# Altium project Receiver.PrjPCB
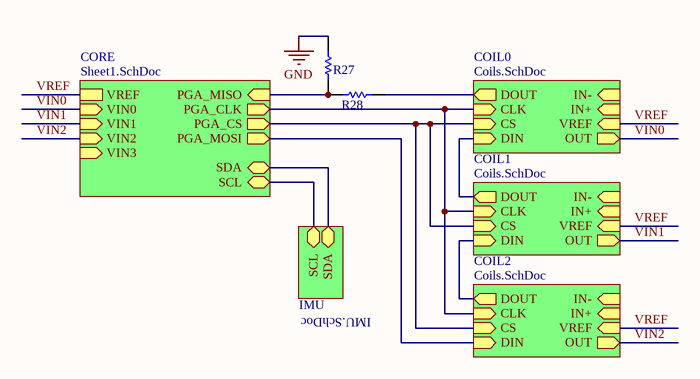
[diagram p0: Top.SchDoc]
4 sheets, 113 parts. Net scope: hierarchical (ports join the sheet entries above them; power ports are global).
Board file: PCB1.PcbDoc
Sheets:
  Top.SchDoc
    CORE = Sheet1.SchDoc
    IMU = IMU.SchDoc
    COIL0 = Coils.SchDoc
    COIL1 = Coils.SchDoc
    COIL2 = Coils.SchDoc

## Sheet Top.SchDoc
size A4

### Parts
R27  10K 1% 0402(1005)  [RESC0402(1005)_N]  (value not drawn)
R28  5K6 5% 0402(1005)  [RESC0402(1005)_N]  (value not drawn)

### Sub-sheets
COIL0 = Coils.SchDoc: DIN (in), CLK (in), CS (in), DOUT (out), OUT (out), IN- (in), IN+ (in), VREF (in)
COIL1 = Coils.SchDoc: DIN (in), CLK (in), CS (in), DOUT (out), OUT (out), IN- (in), IN+ (in), VREF (in)
COIL2 = Coils.SchDoc: DIN (in), CLK (in), CS (in), DOUT (out), OUT (out), IN- (in), IN+ (in), VREF (in)
CORE = Sheet1.SchDoc: SDA (bidir), SCL (bidir), PGA_CLK (out), PGA_MISO (in), PGA_MOSI (out), VREF, VIN0 (in), VIN1 (in), VIN2 (in), VIN3 (in), PGA_CS (out)
IMU = IMU.SchDoc: SDA (bidir), SCL (bidir)

### Nets
GND: R27.1
PGA_CLK: sheet CORE/PGA_CLK, sheet COIL0/CLK, sheet COIL1/CLK, sheet COIL2/CLK
PGA_CS: sheet CORE/PGA_CS, sheet COIL0/CS, sheet COIL1/CS, sheet COIL2/CS
PGA_MISO: R27.2 R28.1 ; sheet CORE/PGA_MISO
PGA_MOSI: sheet CORE/PGA_MOSI, sheet COIL2/DIN
SCL: sheet CORE/SCL, sheet IMU/SCL
SDA: sheet CORE/SDA, sheet IMU/SDA
VIN0: sheet CORE/VIN0, sheet COIL0/OUT
VIN1: sheet CORE/VIN1, sheet COIL1/OUT
VIN2: sheet CORE/VIN2, sheet COIL2/OUT
VREF: sheet CORE/VREF, sheet COIL0/VREF, sheet COIL1/VREF, sheet COIL2/VREF
NetR28_2: R28.2 ; sheet COIL0/DOUT
NetU2A_7: sheet COIL0/DIN, sheet COIL1/DOUT
NetU2B_7: sheet COIL1/DIN, sheet COIL2/DOUT

### Library data of the parts
R27 = CMP-1011-00623-1: 10K 0.063W 1% 0402 (1005 Metric)  SMD; Case-Metric: 1005; Value: 10000.00 Ohm; Case-EIA: 0402; Tolerance: 1 %; Technology: SMT; Power: 0.063 W
R28 = CMP-1011-00092-1: 5K6 0.063W 5% 0402 (1005 Metric)  SMD; Case-EIA: 0402; Case-Metric: 1005; Value: 5600.00 Ohm; Technology: SMT; Tolerance: 5 %; Power: 0.063 W

## Sheet Sheet1.SchDoc
size A4
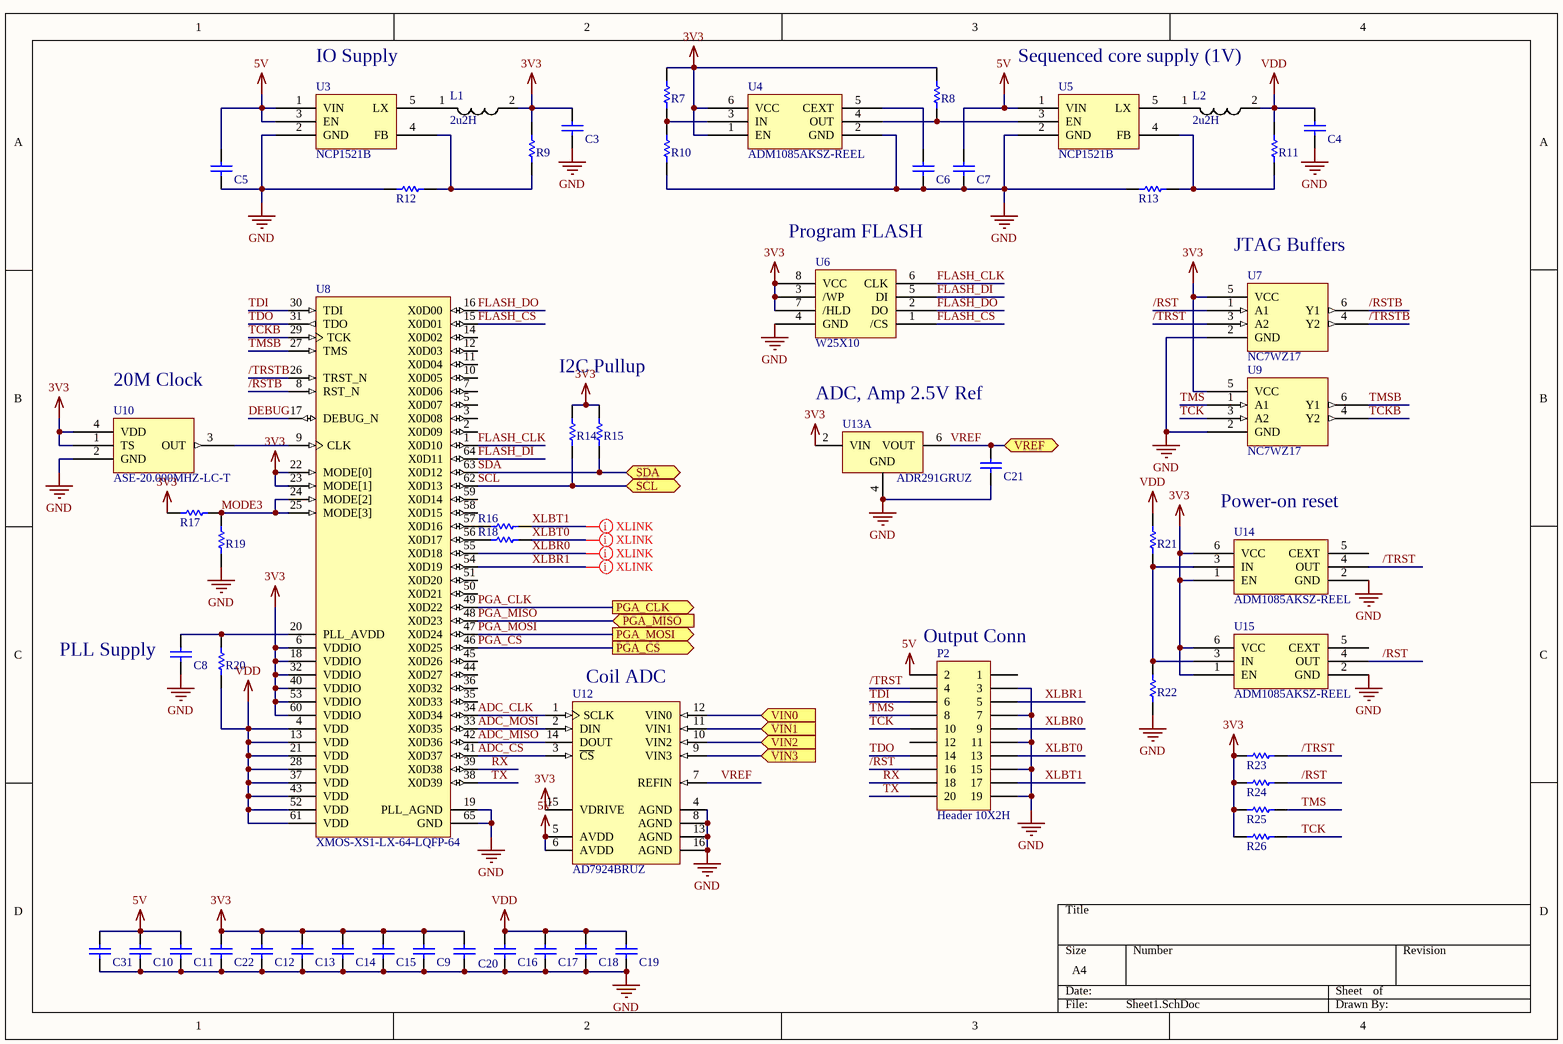
[diagram p1: Sheet1.SchDoc]

### Parts
C3  CAP 10uF 6.3V 0603(1608)  [CAPC0603(1608)100_N]  (value not drawn)
C4  CAP 10uF 6.3V 0603(1608)  [CAPC0603(1608)100_N]  (value not drawn)
C5  CAP 10uF 6.3V 0603(1608)  [CAPC0603(1608)100_N]  (value not drawn)
C6  CAP 10nF 10V 0402(1005)  [CAPC0402(1005)60_N]  (value not drawn)
C7  CAP 10uF 6.3V 0603(1608)  [CAPC0603(1608)100_N]  (value not drawn)
C8  CAP 1uF 16V 0402(1005)  [CAPC0402(1005)60_N]  (value not drawn)
C9  CAP 100nF 25V 0402(1005)  [CAPC0402(1005)60_N]  (value not drawn)
C10  CAP 100nF 25V 0402(1005)  [CAPC0402(1005)60_N]  (value not drawn)
C11  CAP 100nF 25V 0402(1005)  [CAPC0402(1005)60_N]  (value not drawn)
C12  CAP 1uF 16V 0402(1005)  [CAPC0402(1005)60_N]  (value not drawn)
C13  CAP 1uF 16V 0402(1005)  [CAPC0402(1005)60_N]  (value not drawn)
C14  CAP 100nF 25V 0402(1005)  [CAPC0402(1005)60_N]  (value not drawn)
C15  CAP 100nF 25V 0402(1005)  [CAPC0402(1005)60_N]  (value not drawn)
C16  CAP 100nF 25V 0402(1005)  [CAPC0402(1005)60_N]  (value not drawn)
C17  CAP 100nF 25V 0402(1005)  [CAPC0402(1005)60_N]  (value not drawn)
C18  CAP 1uF 16V 0402(1005)  [CAPC0402(1005)60_N]  (value not drawn)
C19  CAP 1uF 16V 0402(1005)  [CAPC0402(1005)60_N]  (value not drawn)
C20  CAP 100nF 25V 0402(1005)  [CAPC0402(1005)60_N]  (value not drawn)
C21  CAP 100nF 25V 0402(1005)  [CAPC0402(1005)60_N]  (value not drawn)
C22  CAP 1uF 16V 0402(1005)  [CAPC0402(1005)60_N]  (value not drawn)
C31  CAP 10uF 6.3V 0603(1608)  [CAPC0603(1608)100_N]  (value not drawn)
L1  2u2H  [2016 Inductor]
L2  2u2H  [2016 Inductor]
P2  Header 10X2H  [HDR2X10H]
R7  36K 1% 0402(1005)  [RESC0402(1005)_N]  (value not drawn)
R8  10K 1% 0402(1005)  [RESC0402(1005)_N]  (value not drawn)
R9  68K 1% 0402(1005)  [RESC0402(1005)_N]  (value not drawn)
R10  10K 1% 0402(1005)  [RESC0402(1005)_N]  (value not drawn)
R11  68K 1% 0402(1005)  [RESC0402(1005)_N]  (value not drawn)
R12  15K 5% 0402(1005)  [RESC0402(1005)_N]  (value not drawn)
R13  100K 1% 0402(1005)  [RESC0402(1005)_N]  (value not drawn)
R14  10K 1% 0402(1005)  [RESC0402(1005)_N]  (value not drawn)
R15  10K 1% 0402(1005)  [RESC0402(1005)_N]  (value not drawn)
R16  33R 5% 0402(1005)  [RESC0402(1005)_N]  (value not drawn)
R17  10K 1% 0402(1005)  [RESC0402(1005)_N]  (value not drawn)
R18  33R 5% 0402(1005)  [RESC0402(1005)_N]  (value not drawn)
R19  Jumper 0402(1005)  [RESC0402(1005)_N]  (value not drawn)
R20  4R7 5% 0402(1005)  [RESC0402(1005)_N]  (value not drawn)
R21  15K 1% 0402(1005)  [RESC0402(1005)_N]  (value not drawn)
R22  36K 1% 0402(1005)  [RESC0402(1005)_N]  (value not drawn)
R23  10K 1% 0402(1005)  [RESC0402(1005)_N]  (value not drawn)
R24  10K 1% 0402(1005)  [RESC0402(1005)_N]  (value not drawn)
R25  10K 1% 0402(1005)  [RESC0402(1005)_N]  (value not drawn)
R26  10K 1% 0402(1005)  [RESC0402(1005)_N]  (value not drawn)
U3  NCP1521B  [TSOP5]
U4  ADM1085AKSZ-REEL  [KS_6]
U5  NCP1521B  [TSOP5]
U6  W25X10  [SO8_N]
U7  NC7WZ17  [KS_6]
U8  XMOS-XS1-LX-64-LQFP-64  [XMOS-LQFP-64_V_MOD]
U9  NC7WZ17  [KS_6]
U10  ASE-20.000MHZ-LC-T  [4-SMD (3.2 x 2.5mm)]
U12  AD7924BRUZ  [RU-16_N]
U13  ADR291GRUZ  [ADI-RU-8_N]  (part A of 2)
U14  ADM1085AKSZ-REEL  [KS_6]
U15  ADM1085AKSZ-REEL  [KS_6]

### Ports
PGA_CLK (out), PGA_CS (out), PGA_MISO (in), PGA_MOSI (out), SCL (bidir), SDA (bidir), VIN0 (in), VIN1 (in), VIN2 (in), VIN3 (in), VREF

### Nets
3V3: C3.2 C9.2 C12.2 C13.2 C14.2 C15.2 C20.2 C22.2 L1.2 R7.2 R8.2 R9.2 R14.2 R15.2 R17.2 R23.2 R24.2 R25.2 R26.2 U4.1(EN) U4.6(VCC) U6.3(/WP) U6.7(/HLD) U6.8(VCC) U7.5(VCC) U8.6(VDDIO) U8.18(VDDIO) U8.22(MODE[0]) U8.23(MODE[1]) U8.32(VDDIO) U8.40(VDDIO) U8.53(VDDIO) U8.60(VDDIO) U9.5(VCC) U10.1(TS) U10.4(VDD) U12.15(VDRIVE) U13.2(VIN) U14.1(EN) U14.6(VCC) U15.1(EN) U15.6(VCC)
5V: C5.1 C7.1 C10.2 C11.2 C31.1 P2.2 U3.1(VIN) U3.3(EN) U5.1(VIN) U12.5(AVDD) U12.6(AVDD)
GND: C3.1 C4.1 C5.2 C6.1 C7.2 C8.2 C9.1 C10.1 C11.1 C12.1 C13.1 C14.1 C15.1 C16.1 C17.1 C18.1 C19.1 C20.1 C21.1 C22.1 C31.2 P2.3 P2.7 P2.11 P2.15 P2.19 R10.1 R12.1 R13.1 R19.1 R22.1 U3.2(GND) U4.2(GND) U5.2(GND) U6.4(GND) U7.2(GND) U8.19(PLL_AGND) U8.65(GND) U9.2(GND) U10.2(GND) U12.4(AGND) U12.8(AGND) U12.13(AGND) U12.16(AGND) U13.4(GND) U14.2(GND) U15.2(GND)
VDD: C4.2 C16.2 C17.2 C18.2 C19.2 L2.2 R11.2 R20.1 R21.2 U8.4(VDD) U8.13(VDD) U8.21(VDD) U8.28(VDD) U8.37(VDD) U8.43(VDD) U8.52(VDD) U8.61(VDD)
/RST: P2.16 R24.1 U7.1(A1) U15.4(OUT)
/RSTB: U7.6(Y1) U8.8(RST_N)
/TRST: P2.4 R23.1 U7.3(A2) U14.4(OUT)
/TRSTB: U7.4(Y2) U8.26(TRST_N)
ADC_CLK: U8.34(X0D34) U12.1(SCLK)
ADC_CS: U8.41(X0D37) U12.3(~{CS})
ADC_MISO: U8.42(X0D36) U12.14(DOUT)
ADC_MOSI: U8.33(X0D35) U12.2(DIN)
DEBUG: U8.17(DEBUG_N)
FLASH_CLK: U6.6(CLK) U8.1(X0D10)
FLASH_CS: U6.1(/CS) U8.15(X0D01)
FLASH_DI: U6.5(DI) U8.64(X0D11)
FLASH_DO: U6.2(DO) U8.16(X0D00)
MODE3: R17.1 R19.2 U8.24(MODE[2]) U8.25(MODE[3])
PGA_CLK: U8.49(X0D22) ; port PGA_CLK
PGA_CS: U8.46(X0D25) ; port PGA_CS
PGA_MISO: U8.48(X0D23) ; port PGA_MISO
PGA_MOSI: U8.47(X0D24) ; port PGA_MOSI
RX: P2.18 U8.39(X0D38)
SCL: R14.1 U8.62(X0D13) ; port SCL
SDA: R15.1 U8.63(X0D12) ; port SDA
TCK: P2.10 R26.1 U9.3(A2)
TCKB: U8.29(TCK) U9.4(Y2)
TDI: P2.6 U8.30(TDI)
TDO: P2.14 U8.31(TDO)
TMS: P2.8 R25.1 U9.1(A1)
TMSB: U8.27(TMS) U9.6(Y1)
TX: P2.20 U8.38(X0D39)
VIN0: U12.12(VIN0) ; port VIN0
VIN1: U12.11(VIN1) ; port VIN1
VIN2: U12.10(VIN2) ; port VIN2
VREF: C21.2 U12.7(REFIN) U13.6(VOUT) ; port VREF
XLBR0: P2.9 U8.55(X0D18)
XLBR1: P2.5 U8.54(X0D19)
XLBT0: P2.13 R18.2
XLBT1: P2.17 R16.2
NetC6_2: C6.2 U4.5(CEXT)
NetC8_1: C8.1 R20.2 U8.20(PLL_AVDD)
NetL1_1: L1.1 U3.5(LX)
NetL2_1: L2.1 U5.5(LX)
NetR7_1: R7.1 R10.2 U4.3(IN)
NetR8_1: R8.1 U4.4(OUT) U5.3(EN)
NetR9_1: R9.1 R12.2 U3.4(FB)
NetR11_1: R11.1 R13.2 U5.4(FB)
NetR16_1: R16.1 U8.57(X0D16)
NetR18_1: R18.1 U8.56(X0D17)
NetR21_1: R21.1 R22.2 U14.3(IN) U15.3(IN)
NetU8_9: U8.9(CLK) U10.3(OUT)
NetU12_9: U12.9(VIN3) ; port VIN3

Not connected (* = marked no-connect by the designer): P2 1 12; U8 2(X0D09) 3(X0D08) 5(X0D07) 7(X0D06) 10(X0D05) 11(X0D04) 12(X0D03) 14(X0D02) 35(X0D33) 36(X0D32) 44(X0D27) 45(X0D26) 50(X0D21) 51(X0D20) 58(X0D15) 59(X0D14); U14 5(CEXT); U15 5(CEXT)

### Layout directives
net class XLB: XLBR0, XLBR1, XLBT0, XLBT1

### Notes on the sheet
- IO Supply
- Sequenced core supply (1V)
- Program FLASH
- (near U7) JTAG Buffers
- (near U10) 20M Clock
- I2C Pullup
- ADC, Amp 2.5V Ref
- Power-on reset
- (near C8) PLL Supply
- (near P2) Output Conn
- (near U12) Coil ADC

### Library data of the parts
C3-C5 C7 C31 = CMP-1035-02797-1: CAP 10uF 6.3V ±20% 0603 (1608 Metric) Thickness 1mm SMD; Case-Metric: 1608; Case-EIA: 0603; Value: 10uF; Technology: SMT; Tolerance: ±20%; Max Thickness: 1 mm; Rated Voltage: 6.3 V
C6 = CMP-1034-01870-1: CAP 10nF 10V ±5% 0402 (1005 Metric) Thickness 0.6mm SMD; Case-EIA: 0402; Case-Metric: 1005; Value: 10nF; Technology: SMT; Max Thickness: 0.6 mm; Tolerance: ±5%; Rated Voltage: 10 V
C8 C12 C13 C18 C19 C22 = CMP-1034-02120-1: CAP 1uF 16V ±20% 0402 (1005 Metric) Thickness 0.6mm SMD; Case-EIA: 0402; Case-Metric: 1005; Rated Voltage: 16 V; Tolerance: ±20%; Value: 1uF; Technology: SMT; Max Thickness: 0.6 mm
C9-C11 C14-C17 C20 C21 = CMP-1034-02073-1: CAP 100nF 25V ±20% 0402 (1005 Metric) Thickness 0.6mm SMD; Case-EIA: 0402; Case-Metric: 1005; Rated Voltage: 25 V; Value: 100nF; Tolerance: ±20%; Max Thickness: 0.6 mm; Technology: SMT
L1 L2 = 2016 Inductor
P2 = Header 10X2H: Header, 10-Pin, Dual row, Right Angle; LatestRevisionDate: 17-Jul-2002; LatestRevisionNote: Re-released for DXP Platform.; Publisher: Altium Limited
R7 R22 = CMP-1011-00685-1: 36K 0.063W 1% 0402 (1005 Metric)  SMD; Value: 36000.00 Ohm; Case-EIA: 0402; Case-Metric: 1005; Power: 0.063 W; Tolerance: 1 %; Technology: SMT
R8 R10 R14 R15 R17 R23-R26 = CMP-1011-00623-1: as R27 on sheet Top; Tolerance: 1 %; Technology: SMT; Power: 0.063 W
R9 R11 = CMP-1011-00717-1: 68K 0.063W 1% 0402 (1005 Metric)  SMD; Value: 68000.00 Ohm; Case-EIA: 0402; Case-Metric: 1005; Tolerance: 1 %; Power: 0.063 W; Technology: SMT
R12 = CMP-1011-00102-1: 15K 0.063W 5% 0402 (1005 Metric)  SMD; Value: 15000.00 Ohm; Case-Metric: 1005; Case-EIA: 0402; Tolerance: 5 %; Technology: SMT; Power: 0.063 W
R13 = CMP-1011-00736-1: 100K 0.063W 1% 0402 (1005 Metric)  SMD; Value: 100000.00 Ohm; Case-EIA: 0402; Case-Metric: 1005; Power: 0.063 W; Tolerance: 1 %; Technology: SMT
R16 R18 = CMP-1011-00038-1: 33R 0.063W 5% 0402 (1005 Metric)  SMD; Case-EIA: 0402; Case-Metric: 1005; Value: 33.00 Ohm; Technology: SMT; Tolerance: 5 %; Power: 0.063 W
R19 = CMP-1011-00001-1: Jumper 0402 (1005 Metric); Tolerance: None; Case-Metric: 1005; Case-EIA: 0402; Value: 0.00 Ohm; Power: None; Technology: SMT
R20 = CMP-1011-00018-1: 4R7 0.063W 5% 0402 (1005 Metric)  SMD; Value: 4.70 Ohm; Case-EIA: 0402; Case-Metric: 1005; Power: 0.063 W; Technology: SMT; Tolerance: 5 %
R21 = CMP-1011-00641-1: 15K 0.063W 1% 0402 (1005 Metric)  SMD; Case-Metric: 1005; Value: 15000.00 Ohm; Case-EIA: 0402; Technology: SMT; Power: 0.063 W; Tolerance: 1 %
U4 U14 U15 = ADM1085AKSZ-REEL: Imported; RefDes: RefDes; Type: DEV; Value: Value; HelpURL: http://www.analog.com/static/imported-files/data_sheets/ADM1085_1086_1087_1088.pdf
U12 = CMP-0313-02203-2: Quad 12-Bit Analog-to-Digital Converter with Serial, SPI Interface and Sequencer, 1MSPS, 0 to +70 degC, RU-16, Pb-Free, Tube; Manufacturer: Analog Devices; Generic Part Number: AD7924; Resolution (Bits): 12; Automotive Qualified: Yes; Channels: 4; Interface: Ser, SPI; Throughput Rate (SPS): 1M; PackageReference: RU-16; ComponentLink1Description: Manufacturer URL; Mounting Technology: Surface Mount; ComponentLink1URL: http://www.analog.com/en/index.html; PackageDescription: 16-Lead Thin Shrink Small Outline Package [TSSOP]; PartNumber: AD7924BRUZ; ComponentLink4Description: Product URL; ComponentLink2Description: Datasheet; PackageVersion: Nov-2002; Packing: Tube; ComponentLink2URL: http://www.analog.com/static/imported-files/data_sheets/AD7904_7914_7924.pdf; ComponentLink4URL: http://www.analog.com/en/analog-to-digital-converters/ad-converters/ad7924/products/product.html; Code_JEDEC: MO-153-AB; RoHS: Y; ComponentLink3URL: http://www.analog.com/static/imported-files/packages/36244347913743854010197452789RU16.pdf; ComponentLink3Description: Package Specification; DatasheetVersion: Rev.B
U13 = CMP-0784-00483-1: Low Noise Micropower Precision Voltage Reference, 2.5 V Output, 2.8 to 15 V Supply, Industrial, 8-pin SOP (RU-8), Tube; Manufacturer: Analog Devices; Min V Supply (V): 2.8; Ref Out TC (ppm/C): 10; Vout: 2.5V; Max V Supply (V): 15; Automotive Qualified: Yes; PartNumber: ADR291GRUZ; ComponentLink4Description: URL Link1; Operating Temp Range: -40 to 125 degC; ComponentLink2Description: Datasheet; Mounting Technology: Surface Mount; Code_JEDEC: MO-153AA; ComponentLink2URL: http://www.analog.com/static/imported-files/data_sheets/ADR291_292.pdf; Packing: Tube; ComponentLink3URL: http://www.analog.com/static/imported-files/packages/359224089841708504863856053953356548880RU08.pdf; PackageDescription: 8-Pin Thin Shrink Small Outline Package, Body 3 x 4.4 mm, Pitch 0.65 mm; ComponentLink1Description: Manufacturer URL; PackageReference: RU-8; ComponentLink4URL: Product URL:http://www.analog.com/en/special-linear-functions/voltage-references/adr291/products/product.html; ComponentLink3Description: Package Specification; PackageVersion: Jan-03; DatasheetVersion: Rev. F; ComponentLink1URL: http://www.analog.com/en/index.html
U3 U5 = NCP1521B: Supplier 1: Digi-Key; Supplier 2: Mouser; Supplier Part Number 1: NCP1521BSNT1GOSTR-ND; Supplier Part Number 2: 863-NCP1521BSNT1G
U6 = W25X10: Supplier 1: Digi-Key; Supplier Part Number 1: W25X10CLSNIG-ND
U7 U9 = NC7WZ17: HelpURL: https://www.fairchildsemi.com/ds/NC/NC7WZ17.pdf
U10 = ASE-20.000MHZ-LC-T: ComponentLink1URL: http://www.abracon.com/Oscillators/ASEseries.pdf; ComponentLink1Description: Datasheet; Frequency: 20.000MHZ

## Sheet IMU.SchDoc
size A4
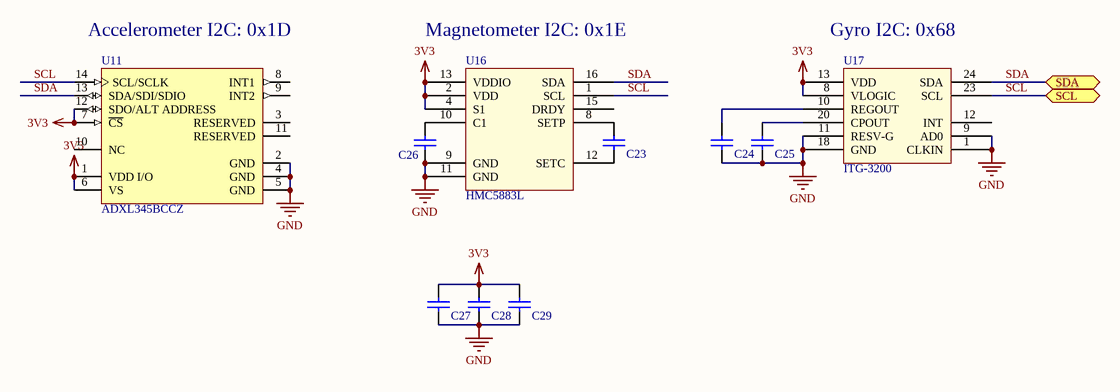
[diagram p2: IMU.SchDoc]

### Parts
C23  CAP 220nF 25V 0402(1005)  [CAPC0402(1005)60_N]  (value not drawn)
C24  CAP 100nF 25V 0402(1005)  [CAPC0402(1005)60_N]  (value not drawn)
C25  CAP 2.2nF 25V 0402(1005)  [CAPC0402(1005)60_N]  (value not drawn)
C26  CAP 4.7uF 6.3V 0402(1005)  [CAPC0402(1005)60_N]  (value not drawn)
C27  CAP 100nF 25V 0402(1005)  [CAPC0402(1005)60_N]  (value not drawn)
C28  CAP 100nF 25V 0402(1005)  [CAPC0402(1005)60_N]  (value not drawn)
C29  CAP 100nF 25V 0402(1005)  [CAPC0402(1005)60_N]  (value not drawn)
U11  ADXL345BCCZ  [ADI-CC-14-1_V]
U16  HMC5883L  [HMC5883L]
U17  ITG-3200  [ITG-3200]

### Ports
SCL (bidir), SDA (bidir)

### Nets
3V3: C27.2 C28.2 C29.2 U11.1(VDD_I/O) U11.6(VS) U11.7(~{CS}) U11.12(SDO/ALT_ADDRESS) U16.2(VDD) U16.4(S1) U16.13(VDDIO) U17.8(VLOGIC) U17.13(VDD)
GND: C24.1 C25.1 C26.1 C27.1 C28.1 C29.1 U11.2(GND) U11.4(GND) U11.5(GND) U16.9(GND) U16.11(GND) U17.1(CLKIN) U17.9(AD0) U17.11(RESV-G) U17.18(GND)
SCL: U11.14(SCL/SCLK) U16.1(SCL) U17.23(SCL) ; port SCL
SDA: U11.13(SDA/SDI/SDIO) U16.16(SDA) U17.24(SDA) ; port SDA
NetC23_1: C23.1 U16.12(SETC)
NetC23_2: C23.2 U16.8(SETP)
NetC24_2: C24.2 U17.10(REGOUT)
NetC25_2: C25.2 U17.20(CPOUT)
NetC26_2: C26.2 U16.10(C1)

Not connected (* = marked no-connect by the designer): U11 3(RESERVED) 8(INT1) 9(INT2) 10(NC) 11(RESERVED); U16 15(DRDY); U17 12(INT)

### Notes on the sheet
- (near U11) Accelerometer I2C: 0x1D
- (near U16) Magnetometer I2C: 0x1E
- (near U17) Gyro I2C: 0x68

### Library data of the parts
C23 = CMP-1034-02093-1: CAP 220nF 25V ±20% 0402 (1005 Metric) Thickness 0.6mm SMD; Case-EIA: 0402; Case-Metric: 1005; Rated Voltage: 25 V; Tolerance: ±20%; Value: 220nF; Technology: SMT; Max Thickness: 0.6 mm
C24 C27-C29 = CMP-1034-02073-1: as C9 on sheet Sheet1; Rated Voltage: 25 V; Value: 100nF; Tolerance: ±20%; Max Thickness: 0.6 mm; Technology: SMT
C25 = CMP-1034-01740-1: CAP 2.2nF 25V ±20% 0402 (1005 Metric) Thickness 0.6mm SMD; Case-EIA: 0402; Case-Metric: 1005; Technology: SMT; Max Thickness: 0.6 mm; Rated Voltage: 25 V; Tolerance: ±20%; Value: 2.2nF
C26 = CMP-1034-02137-1: CAP 4.7uF 6.3V ±20% 0402 (1005 Metric) Thickness 0.6mm SMD; Case-Metric: 1005; Case-EIA: 0402; Technology: SMT; Max Thickness: 0.6 mm; Tolerance: ±20%; Rated Voltage: 6.3 V; Value: 4.7uF
U11 = CMP-0885-00027-1: 3-Axis, +/-2 g / +/-4 g / +/-8 g / +/-16 g Digital Accelerometer with Digital Output, 1.6 KHz BW, Industrial, 14-pin LGA, Tray; Manufacturer: Analog Devices; Sensitivity: 256/128/64/32 LSB/g; Voltage Supply (V): 2.0 to 3.6; Supply Current: 140 uA; # of Axes: 3; -3dB Bandwidth: 1.6 KHz; PackageReference: CC-14-1; ComponentLink1Description: Manufacturer URL; Packing: Tray; ComponentLink4URL: http://www.analog.com/en/mems-sensors/mems-inertial-sensors/adxl345/products/product.html; ComponentLink2URL: http://www.analog.com/static/imported-files/data_sheets/ADXL345.pdf; Mounting Technology: Surface Mount; ComponentLink3URL: http://www.analog.com/static/imported-files/data_sheets/ADXL343.pdf; PartNumber: ADXL345BCCZ; ComponentLink4Description: Product URL; Output Type: Digital; ComponentLink3Description: Package Specification; DatasheetVersion: Rev. D; PackageVersion: 03-16-2010-A, 03/2010; ComponentLink1URL: http://www.analog.com/en/index.html; ComponentLink2Description: Datasheet; PackageDescription: 14-Pin Land Grid Array, 3 x 5 mm Body, 0.8 mm Pitch
U16 = HMC5883L: Supplier 1: Digi-Key; Supplier Part Number 1: 342-1082-1-ND
U17 = ITG-3200: RefDes: RefDes; Type: DEV; Value: Value; Supplier 1: Newark; Supplier Part Number 1: 37T8091

## Sheet Coils.SchDoc
size A4
Used 3 times, as channels COIL0, COIL1, COIL2. Parts and nets are listed once, with the designators drawn on the sheet.
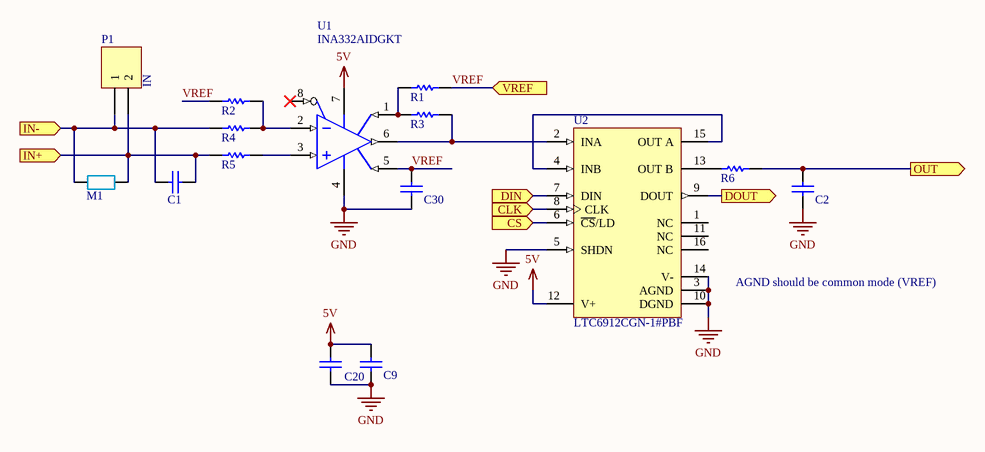
[diagram p3: Coils.SchDoc]

### Parts
C1  CAP 25V 0402(1005)  [CAPC0402(1005)60_N]  (value not drawn)
C2  CAP 100pF 25V 0402(1005)  [CAPC0402(1005)60_N]  (value not drawn)
C9  CAP 100nF 25V 0402(1005)  [CAPC0402(1005)60_N]  (value not drawn)
C20  CAP 100nF 25V 0402(1005)  [CAPC0402(1005)60_N]  (value not drawn)
C30  CAP 100nF 25V 0402(1005)  [CAPC0402(1005)60_N]  (value not drawn)
M1  Multi Footprint  [MULTI]  (value not drawn)
P1  IN  [HDR1X2]
R1  220R 1% 0402(1005)  [RESC0402(1005)_N]  (value not drawn)
R2  10K 1% 0402(1005)  [RESC0402(1005)_N]  (value not drawn)
R3  2K 1% 0402(1005)  [RESC0402(1005)_N]  (value not drawn)
R4  10K 1% 0402(1005)  [RESC0402(1005)_N]  (value not drawn)
R5  10K 1% 0402(1005)  [RESC0402(1005)_N]  (value not drawn)
R6  10K 1% 0402(1005)  [RESC0402(1005)_N]  (value not drawn)
U1  INA332AIDGKT  [TI-DGK8_N]
U2  LTC6912CGN-1#PBF  [LT-GN-16_N]

### Ports
CLK (in), CS (in), DIN (in), DOUT (out), IN+ (in), IN- (in), OUT (out), VREF (in)

### Nets
5V: C9.2 C20.2 U1.7(V+) U2.12(V+)
GND: C2.1 C9.1 C20.1 C30.1 U1.4(V-) U2.3(AGND) U2.5(SHDN) U2.10(DGND) U2.14(V-)
CLK: U2.8(CLK) ; port CLK
CS: U2.6(~{CS}/LD) ; port CS
DIN: U2.7(DIN) ; port DIN
DOUT: U2.9(DOUT) ; port DOUT
IN+: C1.2 M1.2 P1.2 R5.1 ; port IN+
IN-: C1.1 M1.1 P1.1 R4.1 ; port IN-
OUT: C2.2 R6.1 ; port OUT
VREF: C30.2 R1.2 R2.1 U1.5(REF) ; port VREF
NetR1_1: R1.1 R3.1 U1.1(RG)
NetR2_2: R2.2 R4.2 U1.2(VIN-)
NetR3_2: R3.2 U1.6(VOUT) U2.2(INA)
NetR5_2: R5.2 U1.3(VIN+)
NetR6_2: R6.2 U2.13(OUT_B)
NetU2_4: U2.4(INB) U2.15(OUT_A)

Not connected (* = marked no-connect by the designer): U1 8(SHUTDOWN)*; U2 1(NC) 11(NC) 16(NC)

### Channels
COIL0: designators end in A; ports CLK=PGA_CLK CS=PGA_CS DIN=NetU2A_7 DOUT=NetR28_2 IN+=NetC1A_2 IN-=NetC1A_1 OUT=VIN0 VREF=VREF
COIL1: designators end in B; ports CLK=PGA_CLK CS=PGA_CS DIN=NetU2B_7 DOUT=NetU2A_7 IN+=NetC1B_2 IN-=NetC1B_1 OUT=VIN1 VREF=VREF
COIL2: designators end in C; ports CLK=PGA_CLK CS=PGA_CS DIN=PGA_MOSI DOUT=NetU2B_7 IN+=NetC1C_2 IN-=NetC1C_1 OUT=VIN2 VREF=VREF

### Notes on the sheet
- AGND should be common mode (VREF)

### Library data of the parts
C1 = CMP-1034-00714-1: CAP 25V ±1% 0402 (1005 Metric) Thickness 0.6mm SMD; Case-EIA: 0402; Case-Metric: 1005; Rated Voltage: 25 V; Tolerance: ±1%; Technology: SMT; Max Thickness: 0.6 mm
C2 = CMP-1034-01239-1: CAP 100pF 25V ±1% 0402 (1005 Metric) Thickness 0.6mm SMD; Case-Metric: 1005; Case-EIA: 0402; Tolerance: ±1%; Value: 100pF; Rated Voltage: 25 V; Max Thickness: 0.6 mm; Technology: SMT
C9 C20 C30 = CMP-1034-02073-1: as C9 on sheet Sheet1; Rated Voltage: 25 V; Value: 100nF; Tolerance: ±20%; Max Thickness: 0.6 mm; Technology: SMT
M1 = Multi
P1 = Header 2: Header, 2-Pin; LatestRevisionDate: 17-Jul-2002; LatestRevisionNote: Re-released for DXP Platform.; Publisher: Altium Limited
R1 = CMP-1011-00433-1: 220R 0.063W 1% 0402 (1005 Metric)  SMD; Case-Metric: 1005; Value: 220.00 Ohm; Case-EIA: 0402; Technology: SMT; Tolerance: 1 %; Power: 0.063 W
R2 R4-R6 = CMP-1011-00623-1: as R27 on sheet Top; Tolerance: 1 %; Technology: SMT; Power: 0.063 W
R3 = CMP-1011-00542-1: 2K 0.063W 1% 0402 (1005 Metric)  SMD; Case-EIA: 0402; Case-Metric: 1005; Value: 2000.00 Ohm; Technology: SMT; Power: 0.063 W; Tolerance: 1 %
U1 = CMP-0944-00079-1: Low-Power, Single Supply, CMOS, Low Cost, Instrumentation Amplifier, -55 to 125 degC, 8-pin SOP (DGK8), Green (RoHS & no Sb/Br); Manufacturer: Texas Instruments; CMRR(Min)(dB): 60; Noise at 1kHz(Typ)(nV/rt(Hz)): 46; Non-Linearity (+/-)(Max)(%): 0.01; Input Offset (+/-)(Max)(uV): 8000; Gain(V/V): 5 to 1000; Quiescent Current (+/-)(Typ)(mA): 0.415; Number of Channels: 1; Vs(Max)(V): 5.5; Vs(Min)(V): 2.5; Code_JEDEC: MO-187; PartNumber: INA332AIDGKT; Mounting Technology: Surface Mount; ComponentLink2Description: Datasheet; ComponentLink1Description: Manufacturer URL; Input Bias Current (+/-)(Max)(nA): 0.01; ComponentLink3Description: Package Specification; ComponentLink3URL: http://www.ti.com/litv/pdf/mpds028d; DatasheetVersion: SBOS216B; PackageVersion: 4073329/E, 05/2006; ComponentLink1URL: http://www.ti.com/; PackageReference: DGK8; Eco-Plan: Green (RoHS & no Sb/Br); PackageDescription: 8-Pin Thin Small Outline, Body 3 x 3 mm, Pitch 0.65 mm; ComponentLink2URL: http://www.ti.com/general/docs/lit/getliterature.tsp?genericPartNumber=INA332&fileType=pdf; SubFamily: Single Supply
U2 = CMP-0359-00187-2: Dual Channel, Dual Programmable Gain Amplifier with Serial Digital Interface, 30 MHz Typical GBW, 16 V/us Typical SR, 2.7 to 10.5 V, 16-Pin SOP (GN-16), Commercial, Pb-Free; Manufacturer: Linear Technology; Linear Technology Part Number: LTC6912-1; Is (mA) Typical: 1.75; SR (V/us) Typical: 16; Vs Min (V): 2.7; Vs Max (V): 10.5; Channels (#): 2; GBW (MHz) Typical: 30; PackageDescription: 16-Lead Plastic SSOP, Body 4.9 x 3.9 mm, Pitch 0.635 mm; RoHS: Pb-Free; ComponentLink2URL: http://cds.linear.com/docs/en/datasheet/6912fa.pdf; ComponentLink2Description: Datasheet; ComponentLink3URL: http://cds.linear.com/docs/en/packaging/05081641_B_GN16.pdf; ComponentLink1URL: http://www.linear.com/; Type: PGA; DatasheetVersion: Rev. A; PackageReference: LT-GN-16; Mounting Technology: Surface Mount; ComponentLink3Description: Package Specification; PackageVersion: Rev B; Vos (mV) Typical: 2; PartNumber: LTC6912CGN-1#PBF; ComponentLink1Description: Manufacturer URL; RevisionNote: URLs updated

## Nets that join several sheets
3V3: Sheet1 (42 pins), IMU (12 pins)
5V: Sheet1 (11 pins), COIL0 (C9A.2 C20A.2 U1A.7 U2A.12), COIL1 (C9B.2 C20B.2 U1B.7 U2B.12), COIL2 (C9C.2 C20C.2 U1C.7 U2C.12)
GND: Top (R27.1), Sheet1 (47 pins), IMU (15 pins), COIL0 (9 pins), COIL1 (9 pins), COIL2 (9 pins)
NetR28_2: Top (R28.2), COIL0 (U2A.9)
NetU2A_7: COIL0 (U2A.7), COIL1 (U2B.9)
NetU2B_7: COIL1 (U2B.7), COIL2 (U2C.9)
PGA_CLK: Sheet1 (U8.49), COIL0 (U2A.8), COIL1 (U2B.8), COIL2 (U2C.8)
PGA_CS: Sheet1 (U8.46), COIL0 (U2A.6), COIL1 (U2B.6), COIL2 (U2C.6)
PGA_MISO: Top (R27.2 R28.1), Sheet1 (U8.48)
PGA_MOSI: Sheet1 (U8.47), COIL2 (U2C.7)
SCL: Sheet1 (R14.1 U8.62), IMU (U11.14 U16.1 U17.23)
SDA: Sheet1 (R15.1 U8.63), IMU (U11.13 U16.16 U17.24)
VIN0: Sheet1 (U12.12), COIL0 (C2A.2 R6A.1)
VIN1: Sheet1 (U12.11), COIL1 (C2B.2 R6B.1)
VIN2: Sheet1 (U12.10), COIL2 (C2C.2 R6C.1)
VREF: Sheet1 (C21.2 U12.7 U13.6), COIL0 (C30A.2 R1A.2 R2A.1 U1A.5), COIL1 (C30B.2 R1B.2 R2B.1 U1B.5), COIL2 (C30C.2 R1C.2 R2C.1 U1C.5)